# Altium schematic sheet Battery_ByPass.SchDoc
size A4
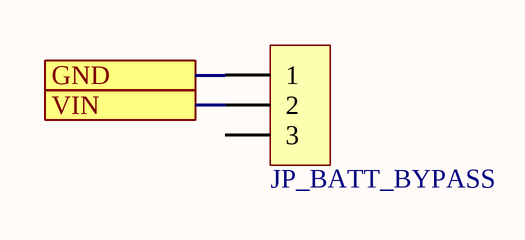
[diagram p0: Battery_ByPass.SchDoc]

## Parts
JP_BATT_BYPASS  HDR-1X3  [HDR2.54-LI-3P]  (value not drawn)

## Ports
GND, VIN

## Nets
GND: JP_BATT_BYPASS.1 ; port GND
VIN: JP_BATT_BYPASS.2 ; port VIN

Not connected (* = marked no-connect by the designer): JP_BATT_BYPASS 3

## Library data of the parts
JP_BATT_BYPASS = Header 3: 3P接插件; 版权归属: 源创客; BOM名称: 3P接插件; 学习资源: www.ooocke.com